# EAGLE design nomcu (EAGLE 9.6.1)
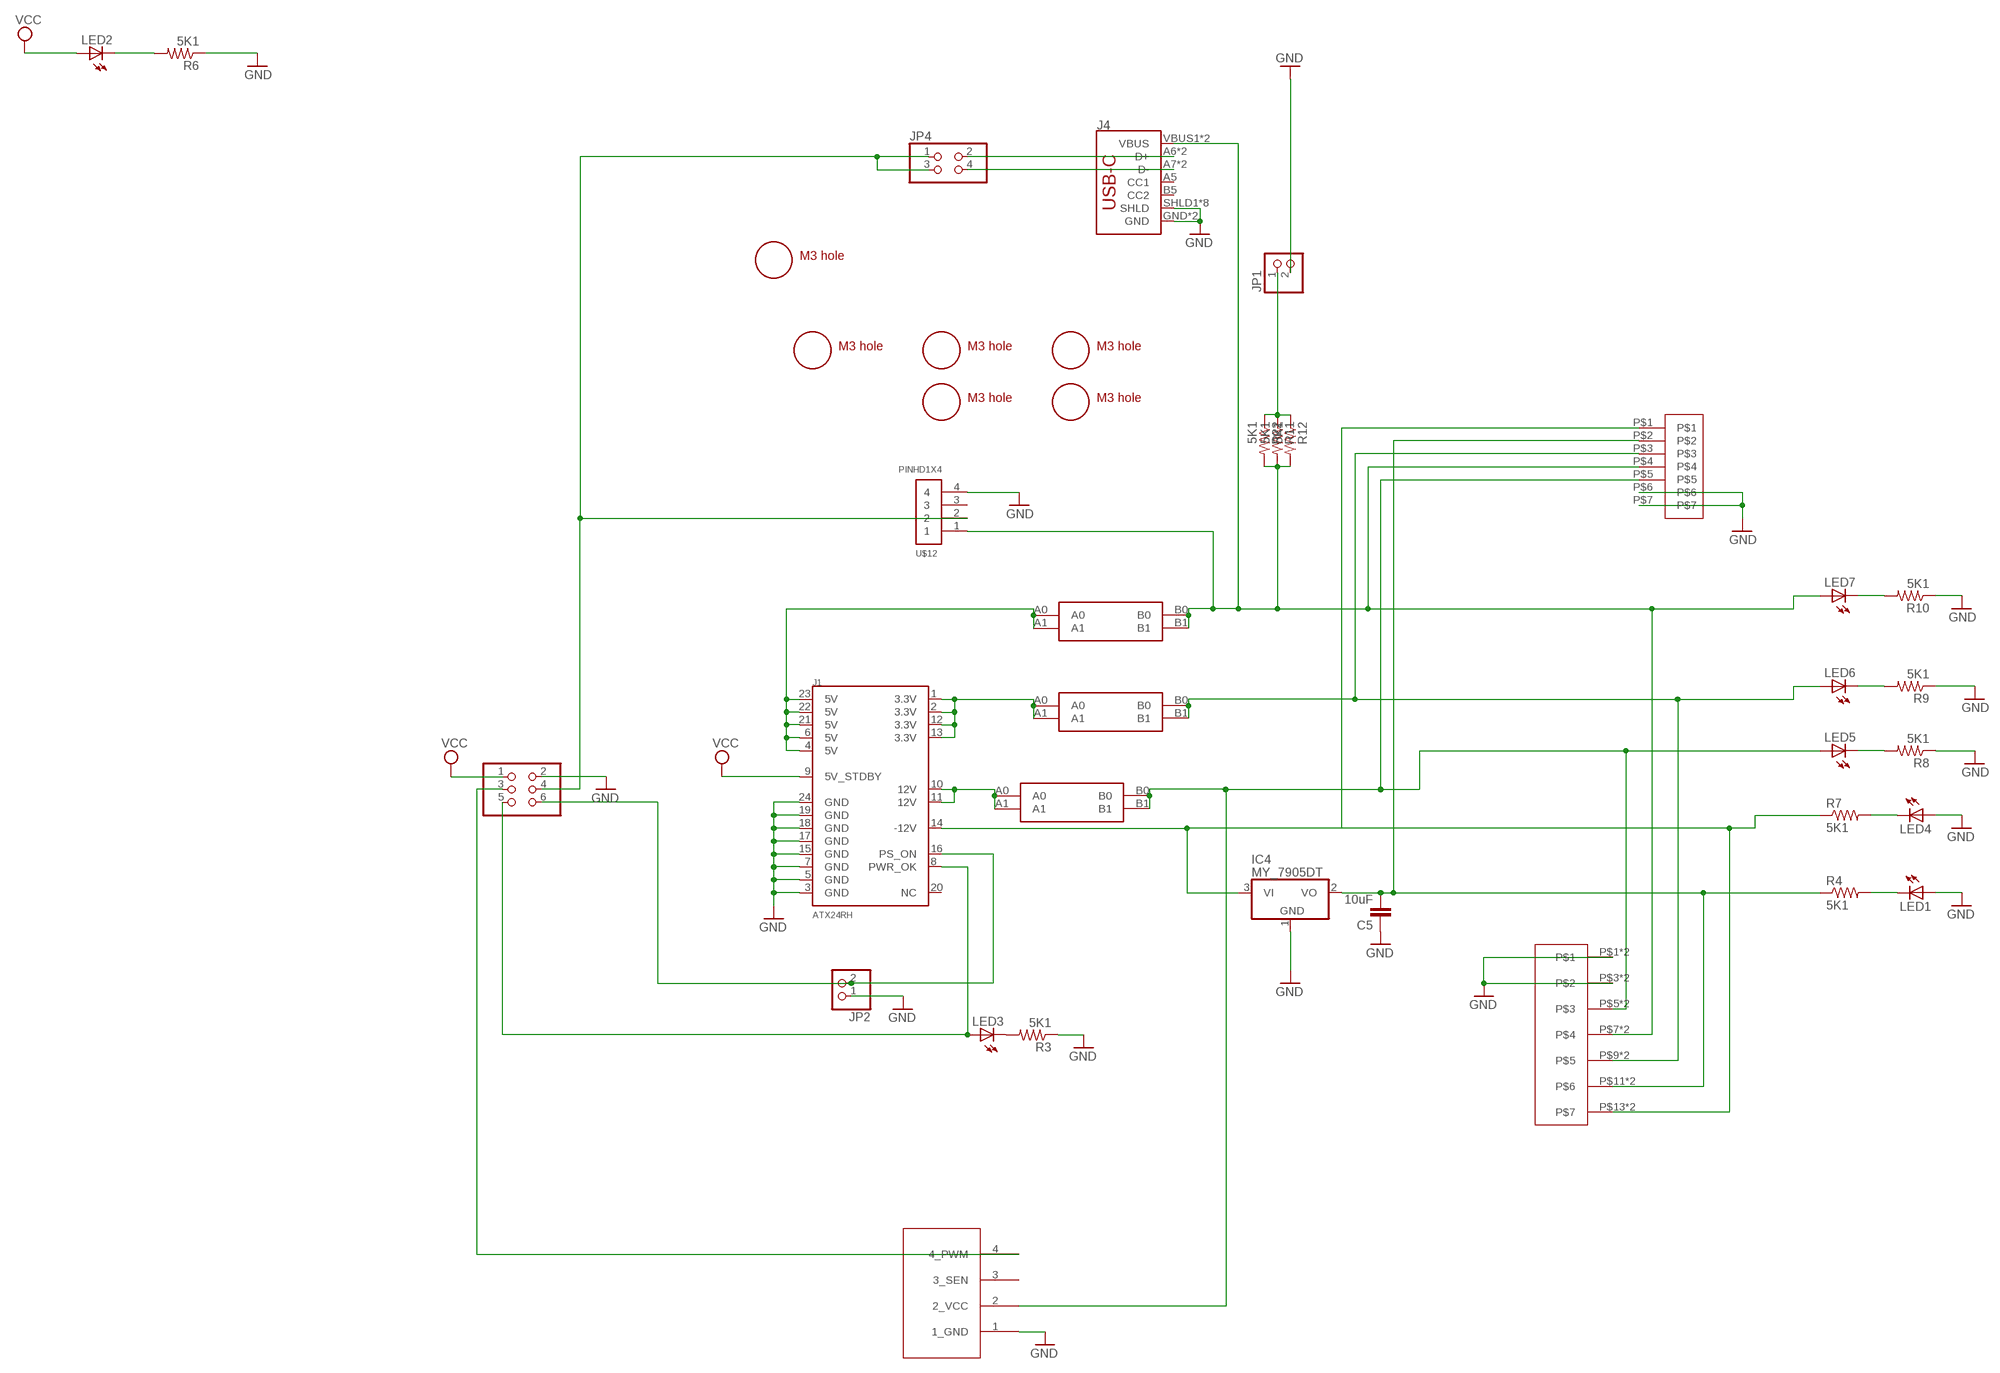
[diagram p0: schematic, sheet 1]

## Parts
C5  10uF  CAP0805  [0805$1]
IC4  MY_7905DT  [ADAFRUIT_TO252]
J1  ATX24RH  [ATX24_RIGHT_ANGLE]
J4  USB_C16PIN  [USB-C-16P]
JP1  PINHD-1X2  [1X02]
JP2  PINHD-1X2  [1X02]
JP3  PINHD-2X3  [2X03]
JP4  PINHD-2X2  [2X02]
JP8  4PIN_FAN  [1X04]
LED1  LEDCHIP-LED0805  [CHIP-LED0805]
LED2  LEDCHIP-LED0805  [CHIP-LED0805]
LED3  LEDCHIP-LED0805  [CHIP-LED0805]
LED4  LEDCHIP-LED0805  [CHIP-LED0805]
LED5  LEDCHIP-LED0805  [CHIP-LED0805]
LED6  LEDCHIP-LED0805  [CHIP-LED0805]
LED7  LEDCHIP-LED0805  [CHIP-LED0805]
R3  5K1  RESISTOR0805-RES  [0805]
R4  5K1  RESISTOR0805-RES  [0805]
R6  5K1  RESISTOR0805-RES  [0805]
R7  5K1  RESISTOR0805-RES  [0805]
R8  5K1  RESISTOR0805-RES  [0805]
R9  5K1  RESISTOR0805-RES  [0805]
R10  5K1  RESISTOR0805-RES  [0805]
R11  5K1  RESISTOR0805-RES  [0805]
R12  5K1  RESISTOR0805-RES  [0805]
R22  5K1  RESISTOR0805-RES  [0805]
U$1  M3_MOUNTING_HOLE  [M3_MOUNTING_HOLE_PACK]
U$2  M3_MOUNTING_HOLE  [M3_MOUNTING_HOLE_PACK]
U$3  M3_MOUNTING_HOLE  [M3_MOUNTING_HOLE_PACK]
U$4  VH396  [396_7P]
U$5  CAR_FUSE_HOLDER3IN1  [FUSE_HOLDER_3IN1]
U$6  M3_MOUNTING_HOLE  [M3_MOUNTING_HOLE_PACK]
U$7  CAR_FUSE_HOLDER3IN1  [FUSE_HOLDER_3IN1]
U$8  CAR_FUSE_HOLDER3IN1  [FUSE_HOLDER_3IN1]
U$9  DG2204R-5.0  [DG2204R]
U$10  M3_MOUNTING_HOLE  [M3_MOUNTING_HOLE_PACK]
U$11  M3_MOUNTING_HOLE  [M3_MOUNTING_HOLE_PACK]
U$12  PINHD1X4  [1X04-CLEANBIG]

## Nets
-5V: C5.2 IC4.2(VO) R4.1 U$4.P$2 U$9.P$11 U$9.P$12
-12V: IC4.3(VI) J1.14(-12V) R7.1 U$4.P$1 U$9.P$13 U$9.P$14
F3V3: LED6.A U$4.P$3 U$7.B0 U$7.B1 U$9.P$9 U$9.P$10
F5V: J4.VBUS1(VBUS) J4.VBUS2(VBUS) LED7.A R11.2 R12.2 R22.2 U$4.P$4 U$8.B0 U$8.B1 U$9.P$7 U$9.P$8 U$12.1
F12V: JP8.2(2_VCC) LED5.A U$4.P$5 U$5.B0 U$5.B1 U$9.P$5 U$9.P$6
GND: C5.1 IC4.1(GND) J1.3(GND) J1.5(GND) J1.7(GND) J1.15(GND) J1.17(GND) J1.18(GND) J1.19(GND) J1.24(GND) J4.GND J4.GND2(GND) J4.SHLD1(SHLD) J4.SHLD2(SHLD) J4.SHLD3(SHLD) J4.SHLD4(SHLD) J4.SHLD5(SHLD) J4.SHLD6(SHLD) J4.SHLD7(SHLD) J4.SHLD8(SHLD) JP1.2 JP2.1 JP3.2 JP8.1(1_GND) LED1.A LED4.A R3.1 R6.1 R8.1 R9.1 R10.1 U$4.P$6 U$4.P$7 U$9.P$1 U$9.P$2 U$9.P$3 U$9.P$4 U$12.4
N$1: LED3.C R3.2
N$3: JP3.3 JP8.4(4_PWM)
N$4: J4.A6(D+) J4.B6(D+) JP4.2
N$5: LED1.C R4.2
N$6: J4.A7(D-) J4.B7(D-) JP4.4
N$7: JP3.4 JP4.1 JP4.3 U$12.2
N$8: LED4.C R7.2
N$9: LED5.C R8.2
N$10: J1.4(5V) J1.6(5V) J1.21(5V) J1.22(5V) J1.23(5V) U$8.A0 U$8.A1
N$11: J1.8(PWR_OK) JP3.5 LED3.A
N$14: J1.1(3.3V) J1.2(3.3V) J1.12(3.3V) J1.13(3.3V) U$7.A0 U$7.A1
N$15: J1.16(PS_ON) JP2.2 JP3.6
N$17: JP1.1 R11.1 R12.1 R22.1
N$18: LED6.C R9.2
N$20: LED7.C R10.2
N$21: J1.10(12V) J1.11(12V) U$5.A0 U$5.A1
N$29: LED2.C R6.2
VCC: J1.9(5V_STDBY) JP3.1 LED2.A
Unconnected: J1.20(NC) J4.A5(CC1) J4.B5(CC2) JP8.3(3_SEN) U$12.3

## Library data of the parts
C5 = atx_power_control:CAP: Capacitor Standard 0603 ceramic capacitor, and 0.1" leaded capacitor.
IC4 = atx_power_control:MY_7905: Positive VOLTAGE REGULATOR Added bigger pads to the TO-92 package
J1 = nomcu:ATX24: ATX24 Pin Power Supply Connector This is a good connector for connecting a computer power supply to a PCB. It's massive, but provides many amps of power at 5V and 12V. SKU: PRT-09498
J4 = SparkFun-Connectors:USB_C: USB Type C 16Pin Connector Super Speed pins not available on the 16-pin purely SMD connector so this part is best for USB 2.0 implementations. D1 and D2 are tied together enabling D+/- no matter which way the cable is plugged into the connector. The two channel configuration pins (CC1/2) are exposed. These are normally connected to ground via 5.1k resistors but can be reconfigured for high current/high power applications.; PROD_ID: CONN-14122
JP1 JP2 = pinhead:PINHD-1X2: PIN HEADER
JP3 = pinhead:PINHD-2X3: PIN HEADER
JP4 = pinhead:PINHD-2X2: PIN HEADER
JP8 = appleii:4PIN_FAN: PIN HEADER
LED1-LED7 = adafruit:LED: LED OSRAM: - CHIPLED LG R971, LG N971, LY N971, LG Q971, LY Q971, LO R971, LY R971 LH N974, LH R974 LS Q976, LO Q976, LY Q976 LO Q996 - Hyper CHIPLED LW Q18S LB Q993, LB Q99A, LB R99A - SideLED LS A670, LO A670, LY A670, LG A670, LP A670 LB A673, LV A673, LT A673, LW A673 LH A674 LY A675 LS A676, LA A676, LO A676, LY A676, LW A676 LS A679, LY A679, LG A679 - Hyper Micro SIDELED® LS Y876, LA Y876, LO Y876, LY Y876 LT Y87S - SmartLED LW L88C, LW L88S LB L89C, LB L89S, LG L890 LS L89K, LO L89K, LY L89K LS L896, LA L896, LO L896, LY L896 - TOPLED LS T670, LO T670, LY T670, LG T670, LP T670 LSG T670, LSP T670, LSY T670, LOP T670, LYG T670 LG T671, LOG T671, LSG T671 LB T673, LV T673, LT T673, LW T673 LH T674 LS T676, LA T676, LO T676, LY T676, LB T676, LH T676, LSB T676, LW T676 LB T67C, LV T67C, LT T67C, LS T67K, LO T67K, LY T67K, LW E67C LS E67B, LA E67B, LO E67B, LY E67B, LB E67C, LV E67C, LT E67C LW T67C LS T679, LY T679, LG T679 LS T770, LO T770, LY T770, LG T770, LP T770 LB T773, LV T773, LT T773, LW T773 LH T774 LS E675, LA E675, LY E675, LS T675 LS T776, LA T776, LO T776, LY T776, LB T776 LHGB T686 LT T68C, LB T68C - Hyper Mini TOPLED® LB M676 - Mini TOPLED Santana® LG M470 LS M47K, LO M47K, LY M47K Source: http://www.osram.convergy.de/
R3 R6 R8-R12 R22 = atx_power_control:RESISTOR: Resistor Basic schematic elements and footprints for 0603, 1206, and PTH resistors.
R4 R7 = SparkFun-Passives:RESISTOR: Resistor Basic schematic elements and footprints for 0603, 1206, and PTH resistors.
U$1-U$3 U$6 U$10 U$11 = a:M3_MOUNTING_HOLE
U$4 = 396_conn:VH396
U$5 U$7 U$8 = atx_power_control:CAR_FUSE_HOLDER
U$9 = atx4vc:DG2204R-5.0
U$12 = adafruit_changed:PINHD1X4

## Board
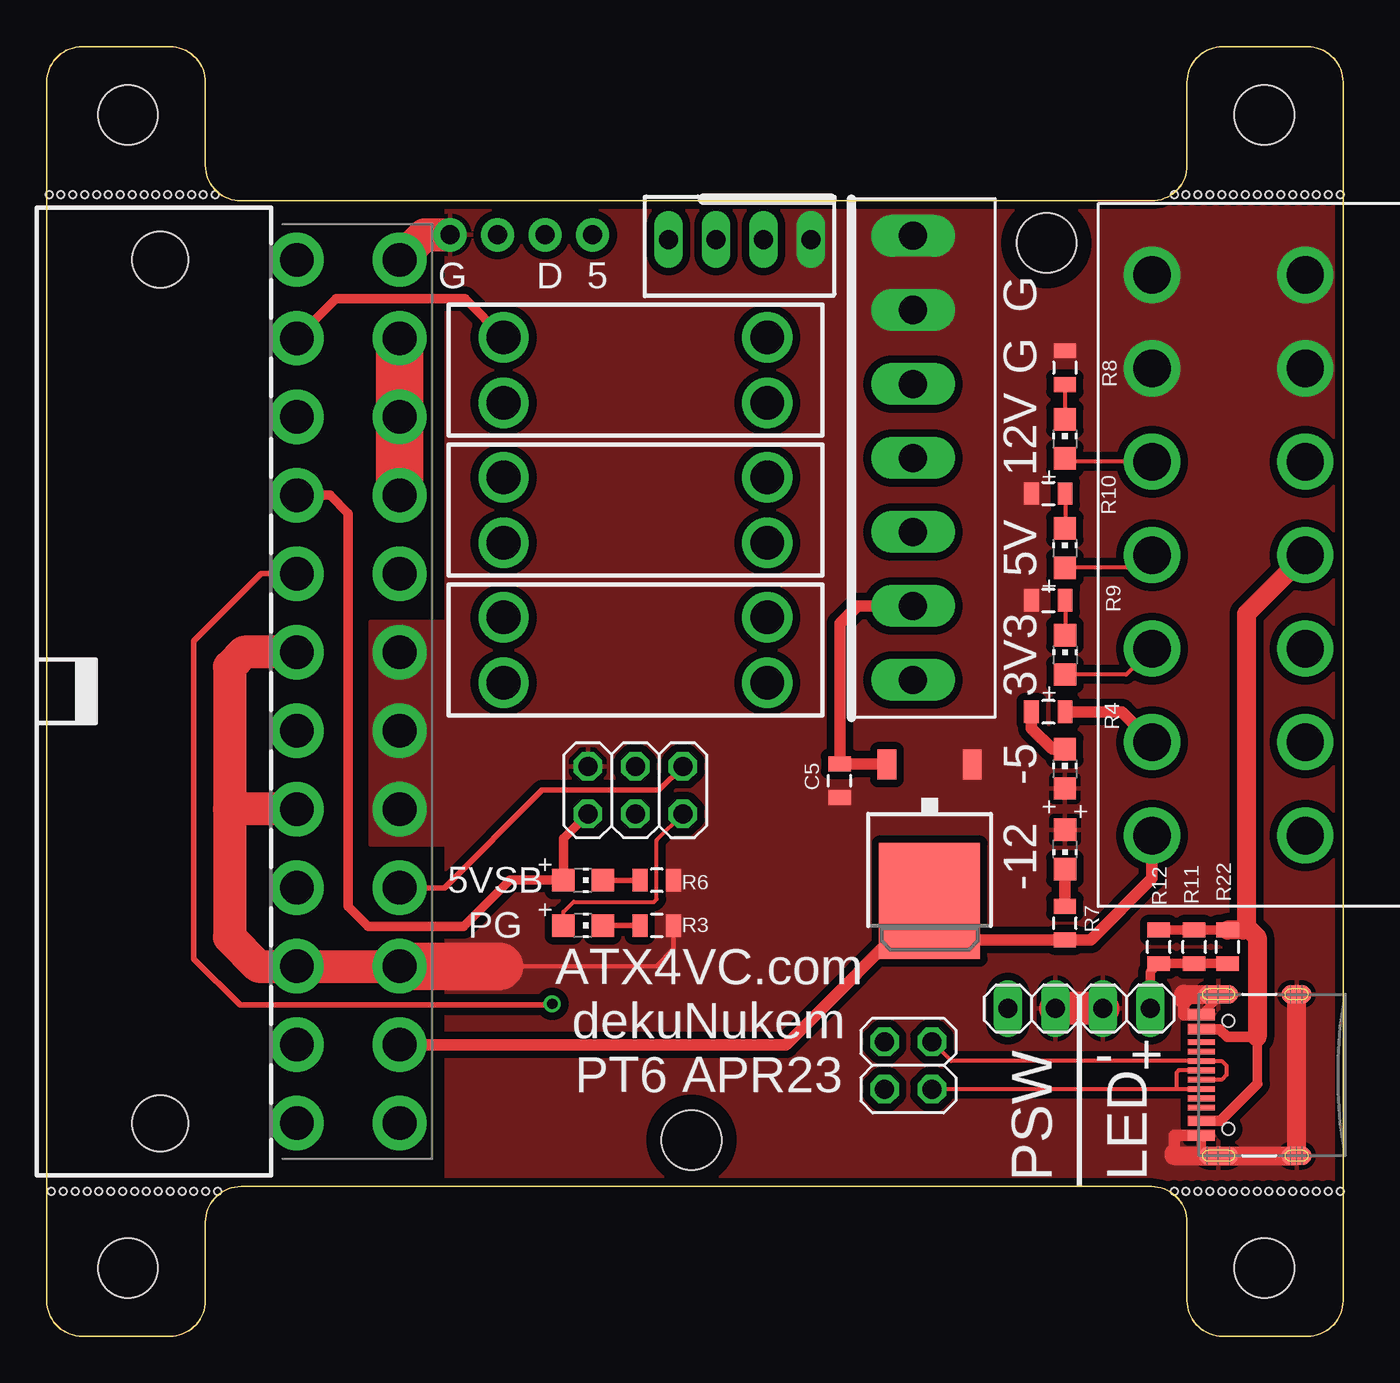
[diagram p1: board, top side]
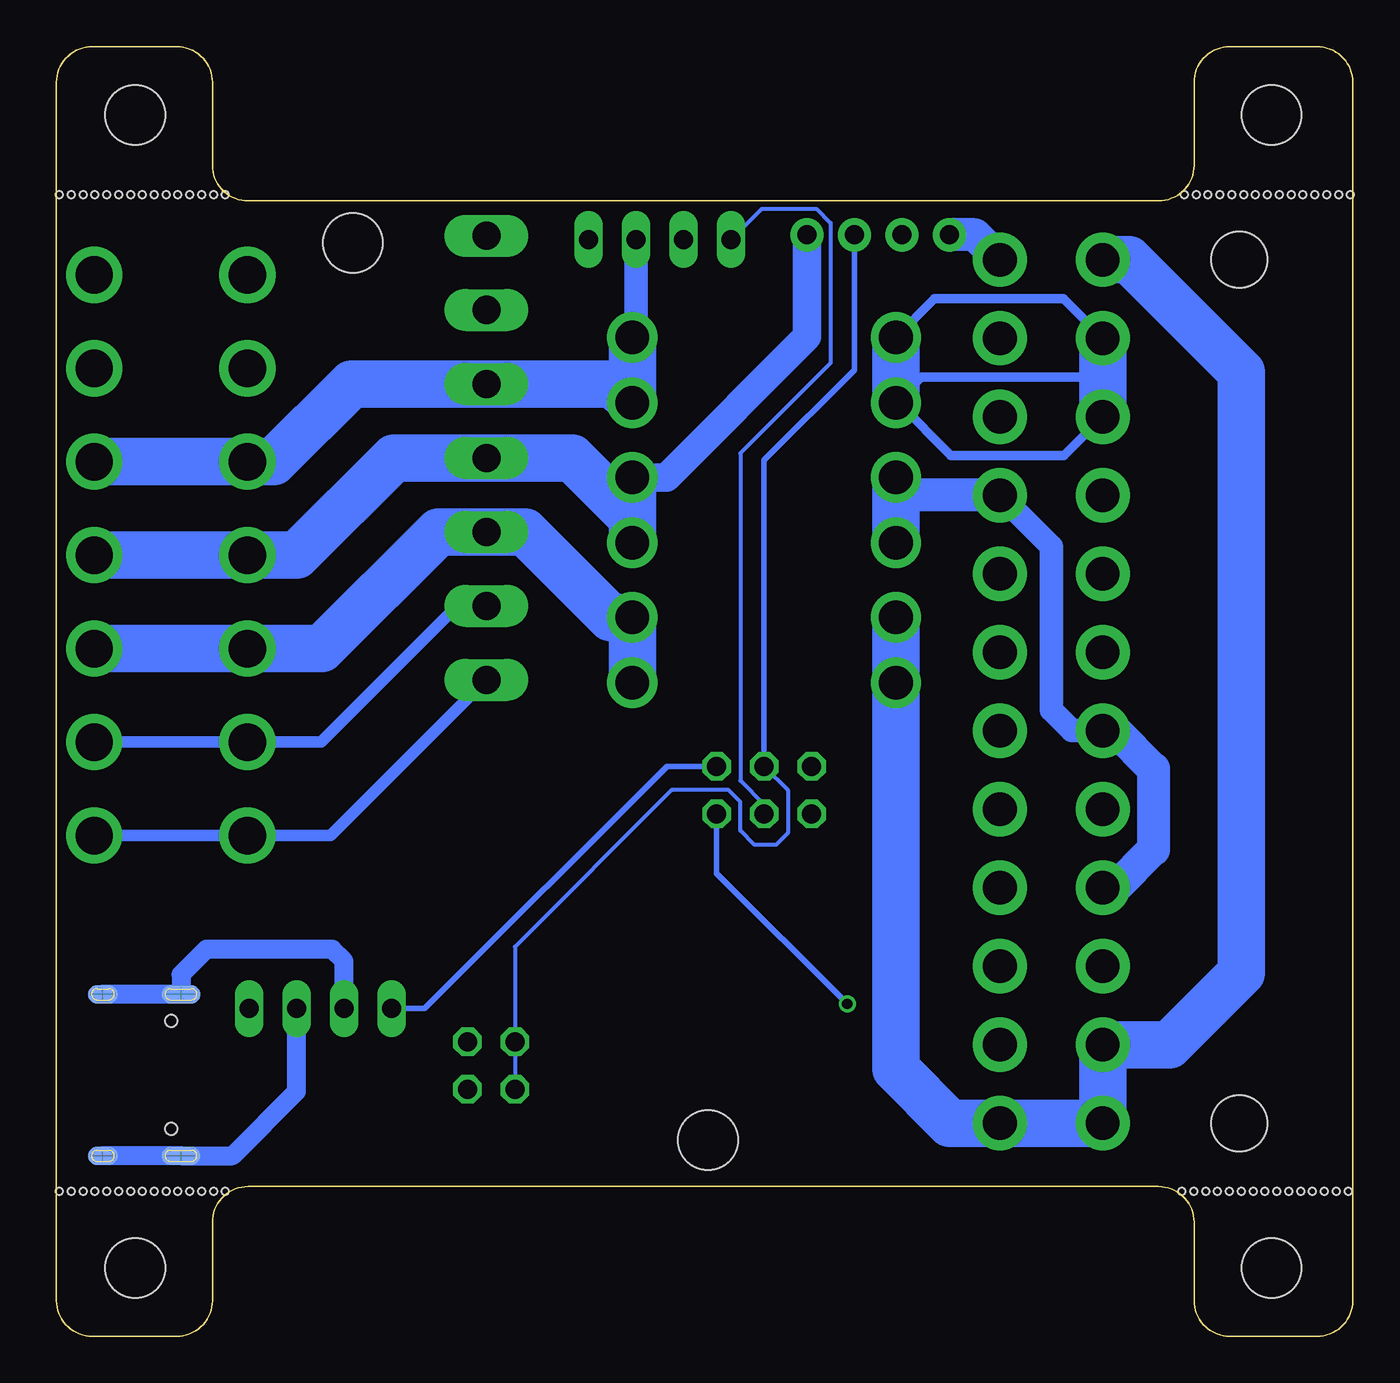
[diagram p2: board, bottom side, seen from below]

Size 69.36 x 69 mm. Coordinates in mm from the lower left corner, seen from the top.
Outline: 10.4,60.75 59.11,60.75 arc90 61.02,62.66 61.02,67.09 arc-90 62.92,69 67.46,69 arc-90 69.36,67.09 69.36,1.9 arc-90 67.46,0 62.92,0 arc-90 61.02,1.9 61.02,6.1 arc90 59.11,8.01 10.4,8.01 arc90 8.49,6.1 8.49,1.9 arc-90 6.59,0 1.91,0 arc-90 0,1.9 0,67.09 arc-90 1.91,69 6.59,69 arc-90 8.49,67.09 8.49,62.66 arc90 10.4,60.75
Copper layers (1*16): Top 0.035mm / dielectric 1.5mm / Bottom 0.035mm
Design rules "deku_2layer_6mil": minimum track width 6mil, minimum drill 15mil, track to track 6mil, track to pad 6mil, pad to pad 6mil, via to via 6mil, smd to smd 6mil, copper to edge 10mil, drill to drill 6mil, minimum pad ring 7mil, minimum via ring 7mil, stop-mask expansion 4mil, vias tented up to drill 25mil, thermal gap 10mil
Holes 0.38 mm at 0.13,61.09 0.76,61.09 1.4,61.09 2.03,61.09 2.67,61.09 3.3,61.09 3.94,61.09 4.57,61.09 5.21,61.09 5.84,61.09 6.48,61.09 7.11,61.09 7.75,61.09 8.38,61.09 0.25,7.76 0.89,7.76 1.52,7.76 2.16,7.76 2.79,7.76 3.43,7.76 4.06,7.76 4.7,7.76 5.33,7.76 5.97,7.76 6.6,7.76 7.24,7.76 7.87,7.76 8.51,7.76 60.33,7.76 60.96,7.76 61.59,7.76 62.23,7.76 62.87,7.76 63.5,7.76 64.14,7.76 64.77,7.76 65.41,7.76 66.04,7.76 66.67,7.76 67.31,7.76 67.94,7.76 68.58,7.76 60.33,61.09 60.96,61.09 61.59,61.09 62.23,61.09 62.87,61.09 63.5,61.09 64.14,61.09 64.77,61.09 65.41,61.09 66.04,61.09 66.67,61.09 67.31,61.09 67.94,61.09 68.58,61.09 9.14,7.76 69.22,7.76 69.22,61.09 9.02,61.09
tRestrict: area 0.3,-0.3 to 8.3,7.7; area 0.3,61.3 to 8.3,69.3; area 61.2,61.4 to 69.2,69.4; area 61.2,-0.3 to 69.2,7.7
bRestrict: area 0.3,-0.3 to 8.3,7.7; area 61.2,-0.3 to 69.2,7.7; area 0.3,61.3 to 8.3,69.3; area 61.2,61.4 to 69.2,69.4

### Footprints (pad centres in the part's own frame; a part is rotated, then mirrored left to right if it is on the bottom)
0805$1 = smd 0.8 x 1.2: 1 -0.9,0; 2 0.9,0
ADAFRUIT_TO252 = smd 1 x 1.6: 1 -2.28,-4.8; 2 2.28,-4.8 | smd 5.4 x 6.2: 3 0,2.5
ATX24_RIGHT_ANGLE = drill 1.8 pad 2.9: 1 23.1,4.76; 2 18.9,4.76; 3 14.7,4.76; 4 10.5,4.76; 5 6.3,4.76; 6 2.1,4.76; 7 -2.1,4.76; 8 -6.3,4.76; 9 -10.5,4.76; 10 -14.7,4.76; 11 -18.9,4.76; 12 -23.1,4.76; 13 23.1,10.26; 14 18.9,10.26; 15 14.7,10.26; 16 10.5,10.26; 17 6.3,10.26; 18 2.1,10.26; 19 -2.1,10.26; 20 -6.3,10.26; 21 -10.5,10.26; 22 -14.7,10.26; 23 -18.9,10.26; 24 -23.1,10.26 | hole 3: -23.1,-2.54; 23.1,-2.54
USB-C-16P = smd 0.3 x 1.45: A5 -1.25,0; A6 -0.25,0; A7 0.25,0; A8 1.25,0; B5 1.75,0; B6 0.75,0; B7 -0.75,0; B8 -1.75,0 | smd 0.6 x 1.45: GND -3.225,0; GND2 3.225,0 | smd 1 x 2.1: SHLD1 -4.32,-0.915; SHLD2 4.32,-0.915 | smd 1 x 2.1 bottom: SHLD3 -4.32,-0.915; SHLD4 4.32,-0.915 | smd 1 x 1.6: SHLD5 -4.32,-5.095; SHLD8 4.32,-5.095 | smd 1 x 1.6 bottom: SHLD6 -4.32,-5.095; SHLD7 4.32,-5.095 | smd 0.55 x 1.45: VBUS1 -2.45,0; VBUS2 2.45,0 | hole 0.65: -2.89,-1.445; 2.89,-1.445
1X02 = drill 1.016 long: 1 -1.27,0; 2 1.27,0
2X03 = drill 1.016 octagon: 1 -2.54,-1.27; 2 -2.54,1.27; 3 0,-1.27; 4 0,1.27; 5 2.54,-1.27; 6 2.54,1.27
2X02 = drill 1.016 octagon: 1 -1.27,-1.27; 2 -1.27,1.27; 3 1.27,-1.27; 4 1.27,1.27
1X04 = drill 1.016 long: 1 -3.81,0; 2 -1.27,0; 3 1.27,0; 4 3.81,0
CHIP-LED0805 = smd 1.2 x 1.2: A 0,-1.05; C 0,1.05
0805 = smd 0.8 x 1.2: 1 -0.9,0; 2 0.9,0
M3_MOUNTING_HOLE_PACK = hole 3.2: 0,0
396_7P = drill 1.5 long: P$1 -11.88,0; P$2 -7.92,0; P$3 -3.96,0; P$4 0,0; P$5 3.96,0; P$6 7.92,0; P$7 11.88,0
FUSE_HOLDER_3IN1 = drill 1.8: A0 -7.05,1.75; A1 -7.05,-1.75; B0 7.05,1.75; B1 7.05,-1.75
DG2204R = drill 2: P$1 -15,4.1; P$2 -15,-4.1; P$3 -10,4.1; P$4 -10,-4.1; P$5 -5,4.1; P$6 -5,-4.1; P$7 0,4.1; P$8 0,-4.1; P$9 5,4.1; P$10 5,-4.1; P$11 10,4.1; P$12 10,-4.1; P$13 15,4.1; P$14 15,-4.1
1X04-CLEANBIG = drill 1.016 pad 1.778: 1 -3.81,0; 2 -1.27,0; 3 1.27,0; 4 3.81,0

### Placement (x,y rotation side)
C5  42.42,29.73 90 top
IC4  47.24,25.79 180 top
J1  8.62,34.5 270 top
J4  61.78,13.98 90 top
JP1  57.78,17.53 180 top
JP2  52.7,17.53 180 top
JP3  31.5,29.22 0 top
JP4  46.1,14.49 270 top
JP8  37.08,58.68 180 top
LED1  54.48,30.36 0 top
LED2  28.7,24.39 270 top
LED3  28.7,21.98 270 top
LED4  54.48,26.04 180 top
LED5  54.48,48.01 0 top
LED6  54.48,36.46 0 top
LED7  54.48,42.17 0 top
R3  32.64,21.98 180 top
R4  53.59,33.41 180 top
R6  32.64,24.39 180 top
R7  54.48,22.11 90 top
R8  54.48,51.82 270 top
R9  53.59,39.38 0 top
R10  53.59,45.09 0 top
R11  61.41,20.84 90 top
R12  59.5,20.84 90 top
R22  63.18,20.84 90 top
U$1  65.15,3.64 0 top
U$2  4.35,65.36 0 top
U$3  65.15,65.36 0 top
U$4  46.35,47 90 top
U$5  31.5,51.7 0 top
U$6  53.5,58.5 0 top
U$7  31.5,36.71 0 top
U$8  31.5,44.2 0 top
U$9  63.25,41.79 270 top
U$10  4.35,3.64 0 top
U$11  34.5,10.5 0 top
U$12  25.4,58.94 180 top

### Tracks (layer width: path | path; a pad name or v marks a point on that pad's centre or on a via)
-5V
  Top 0.61: R4.1 57.53,33.41 U$9.P$12 | U$4.P$2 43.39,39.08 42.46,38.15 42.46,30.59 C5.2 44.93,30.63 IC4.2
  Bottom 0.61: U$9.P$11 U$9.P$12 55.21,31.79 47.92,39.08 U$4.P$2
-12V
  Top 0.61: U$9.P$14 59.15,24.48 55.87,21.21 R7.1 49.33,21.21 IC4.3 39.55,15.6 J1.14
  Bottom 0.61: U$4.P$1 46.37,35.12 54.7,26.79 U$9.P$14 U$9.P$13
F3V3
  Top 0.203: U$9.P$10 57.76,35.41 LED6.A
  Bottom 2.54: U$7.B1 U$7.B0 39.72,38.46 44.3,43.04 U$4.P$3 48.92,43.04 55.16,36.79 U$9.P$10 U$9.P$9
F5V
  Top 0.203: U$9.P$8 58.48,41.12 LED7.A
  Top 0.508: R12.2 R11.2 R22.2 | 64.77,13.49 64.77,16.01
  Top 0.559: J4.VBUS2 62.75,16.43 63.17,16.01 64.77,16.01 | J4.VBUS1 62.8,11.53 64.77,13.49
  Top 1.016: U$9.P$7 64.2,38.64 64.2,21.91 | 64.77,16.01 64.77,21.34 64.2,21.91 | 64.2,21.91 64.02,21.74 R22.2
  Bottom 1.524: U$8.B0 36.73,45.95 29.21,53.48 U$12.1
  Bottom 2.54: U$8.B0 U$8.B1 38.55,43.76 41.78,47 U$4.P$4 51.31,47 56.52,41.79 U$9.P$8 U$9.P$7
F12V
  Top 0.203: U$9.P$6 54.65,46.79 LED5.A
  Bottom 1.27: JP8.2 38.35,53.64 U$5.B0
  Bottom 2.54: U$5.B0 U$5.B1 39.56,50.96 U$4.P$5 53.57,50.96 57.74,46.79 U$9.P$6 U$9.P$5
GND
  Top 0.254: R3.1 33.54,20.72 32.62,19.8 24.24,19.8
  Top 0.508: J4.GND 61.78,9.66 J4.SHLD3 | J4.GND2 62.7,18.12 J4.SHLD4
  Top 0.61: J4.GND2 60.83,17.2 60.83,18.04 | J4.GND 60.33,10.75 60.33,9.79
  Top 1.016: 60.83,18.04 60.83,18.3 J4.SHLD4 | 60.33,9.79 60.33,9.66 J4.SHLD3 J4.SHLD5 J4.SHLD8
  Top 1.778: J1.7 10.56,36.6 9.78,35.82 9.78,28.2 | J1.15 J1.3 11.32,19.8 9.78,21.34 9.78,28.2 | U$12.4 20.21,58.94 J1.24 | JP1.2 JP2.1 | J1.5 9.78,28.2
  Top 2.54: 24.24,19.8 J1.15
  Bottom 1.016: J4.SHLD8 J4.SHLD4 62.7,19.35 61.34,20.71 54.61,20.71 53.98,20.07 JP2.1 | J4.SHLD5 J4.SHLD3 59.95,9.66 56.52,13.09 JP1.2
  Bottom 1.778: J1.24 20.21,58.94 U$12.4
  pour Top (isolate 0.406): 21.34,8.01 69.49,8.01 69.49,60.74 21.34,60.74
  pour Top: 17.27,38.23 17.27,26.3 22.1,26.3 22.1,38.23
N$1
  Top 0.305: LED3.C R3.2
N$3
  Bottom 0.203: JP8.4 31.62,60.33 28.7,60.33 27.94,59.57 27.94,52.08 32.77,47.25 32.77,29.73 31.5,28.46 JP3.3
N$4
  Top 0.203: J4.A6 62.87,13.73 63.12,13.98 63.12,14.49 62.88,14.73 J4.B6 48.4,14.73 JP4.2
N$5
  Top 0.61: R4.2 52.69,32.53 53.81,31.41 LED1.C
N$6
  Top 0.203: J4.A7 60.58,14.23 60.45,14.11 60.45,13.23 | JP4.4 47.38,13.23 60.45,13.23 | 60.45,13.23 J4.B7
N$7
  Bottom 0.203: JP3.4 30.23,29.22 30.23,26.93 30.86,26.3 32,26.3 32.77,27.06 32.77,28.58 33.4,29.22 36.45,29.22 44.83,20.84 JP4.1 JP4.3
  Bottom 0.305: JP3.4 31.5,46.87 26.67,51.7 U$12.2
N$8
  Top 0.61: R7.2 LED4.C
N$9
  Top 0.203: R8.2 LED5.C
N$10
  Top 2.54: J1.23 J1.22 J1.21
  Bottom 1.27: J1.21 16.13,42.25 16.13,33.5 15.03,32.4 J1.6
  Bottom 1.778: J1.21 23.49,45 U$8.A0 | J1.6 12.71,32.4 10.67,30.36 10.67,26.04 12.71,24 J1.4
  Bottom 2.54: U$8.A0 U$8.A1
N$11  (via drill 0.55)
  Top 0.203: LED3.A 27.65,22.71 28.19,23.25 32.51,23.25 32.64,23.38 32.64,26.55 JP3.5
  Top 0.305: J1.8 11.47,40.8 7.87,37.2 7.87,20.2 10.34,17.74 27,17.74 v27.05,17.79
  Bottom 0.305: v27.05,17.79 34.04,24.77 JP3.5
N$14
  Bottom 2.54: J1.12 11.98,57.6 5.97,51.59 5.97,19.44 9.81,15.6 J1.2 J1.1 J1.13 21.55,11.4 24.45,14.29 U$7.A1 U$7.A0
N$15
  Top 0.305: J1.16 21.29,24 26.51,29.22 32.77,29.22 JP3.6
  Bottom 0.305: JP2.2 49.66,17.53 36.7,30.49 JP3.6
N$17
  Top 0.508: R22.1 R11.1 R12.1 59.05,19.49 JP1.1
N$18
  Top 0.203: LED6.C 54.49,37.52 R9.2
N$20
  Top 0.203: R10.2 54.49,43.23 LED7.C
N$21
  Top 0.508: J1.11 15.49,55.51 22.39,55.51 U$5.A0
  Bottom 0.508: J1.11 15.49,55.51 22.39,55.51 U$5.A0 | U$5.A1 23.08,51.32 13.38,51.32 | J1.10 15.45,47.12 21.5,47.12 24.32,49.95
  Bottom 0.61: 24.32,49.95 U$5.A1
  Bottom 2.54: J1.11 13.38,51.32 J1.10 | U$5.A0 U$5.A1
N$29
  Top 0.305: LED2.C R6.2
VCC
  Top 0.508: J1.9 15.16,45 16.13,44.03 16.13,23 17.2,21.93 22.3,21.93 24.8,24.43 27.69,24.43 LED2.A 27.65,26.64 JP3.1

### Text on the board
tNames: G | D | 5 | G | G | 12V | 5V | 3V3 | -5 | -12 | 5VSB | PG | ATX4VC.com / dekuNukem / PT6 APR23 | - + | PSW | LED